# Altium schematic sheet CSA.SchDoc
size A
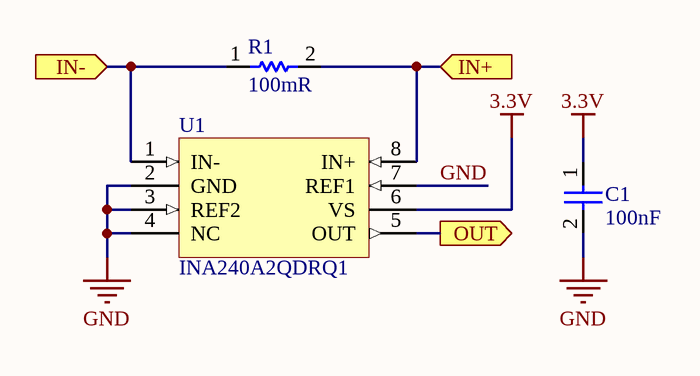
[diagram p0: CSA.SchDoc]

## Parts
C1  100nF  [MURA-0603_H_0.9_N]
R1  100mR  [RESC2512(6432)_N]
U1  INA240A2QDRQ1  [D0008A_M]

## Ports
IN+ (in), IN- (in), OUT (out)

## Nets
3.3V: C1.1 U1.6(VS)
GND: C1.2 U1.2(GND) U1.3(REF2) U1.4(NC) U1.7(REF1)
IN+: R1.2 U1.8(IN+) ; port IN+
IN-: R1.1 U1.1(IN-) ; port IN-
OUT: U1.5(OUT) ; port OUT

## Library data of the parts
C1 = C0603C104M4RAC7411: X7R,.1UF,20%,16V,UNMARKED, 1.0A 40V ROHS 3K<AZ; Manufacturer: KEMET; Dielectric Material: Ceramic; Dissipation Factor: 3.5%; Supplier 1: Digi-Key; Manufacturer Part Number: C0603C104M4RAC7411; RoHS: Yes; Category: Ceramic Capacitors; Stock 1: 270000; Pricing 1: 15000=0.00520, 30000=0.00494, 75000=0.00442, 105000=0.00358 (USD); Mount: Surface Mount; Case/Package: 0603; Case Code (Imperial): 0603; Case Code (Metric): 1608; Min Operating Temperature: -55°C; Max Operating Temperature: 125°C; Capacitance: 100nF; Package Quantity: 10000; Voltage Rating: 16V; Tolerance: 20%; Packaging: Tape and Reel; Voltage Rating (DC): 16V; Dielectric: X7R; Termination: SMD/SMT; Length: 1.6mm; Height: 0.8mm; Width: 0.8mm; Lead Pitch: 0.7mm; Thickness: 0.034inch; Depth: 0.8mm; Radiation Hardening: No; ComponentLink1URL: http://www.mouser.com/ds/2/212/KEM_C1002_X7R_SMD-1102033.pdf?src-supplier=Mouser; ComponentLink1Description: http://www.mouser.com/ds/2/212/KEM_C1002_X7R_SMD-1102033.pdf?src-supplier=Mouser; ComponentLink2URL: http://www.farnell.com/datasheets/2747785.pdf?src-supplier=Farnell; ComponentLink2Description: http://www.farnell.com/datasheets/2747785.pdf?src-supplier=Farnell; ComponentLink3URL: http://components.arrow.com/part/dataview/3446650S8993799N7429?src-supplier=Arrow; ComponentLink3Description: http://components.arrow.com/part/dataview/3446650S8993799N7429?src-supplier=Arrow; ComponentLink4URL: http://www.jameco.com/Jameco/Products/ProdDS/1565046.pdf?src-supplier=Jameco; ComponentLink4Description: http://www.jameco.com/Jameco/Products/ProdDS/1565046.pdf?src-supplier=Jameco; ComponentLink5URL: http://capacitoredge.kemet.com/capedge2/DataSheet?pn=C0603C104M4RAC7411&src-supplier=Avnet; ComponentLink5Description: http://capacitoredge.kemet.com/capedge2/DataSheet?pn=C0603C104M4RAC7411&src-supplier=Avnet; ComponentLink6URL: https://api.kemet.com/component-edge/download/datasheet/C0603C104M4RAC7411.pdf?src-supplier=Digi-Key; ComponentLink6Description: https://api.kemet.com/component-edge/download/datasheet/C0603C104M4RAC7411.pdf?src-supplier=Digi-Key; ComponentLink7URL: http://www.kemet.com/docfinder?Partnumber=C0603C104M4RAC7411&src-supplier=Digi-Key; ComponentLink7Description: http://www.kemet.com/docfinder?Partnumber=C0603C104M4RAC7411&src-supplier=Digi-Key; ComponentLink8URL: https://www.verical.com/server-webapp/html/getDatasheet?partID=58458&src-supplier=Verical; ComponentLink8Description: https://www.verical.com/server-webapp/html/getDatasheet?partID=58458&src-supplier=Verical; ComponentLink9URL: http://capacitoredge.kemet.com/capedge2/DataSheet?pn=C0603C104M4RAC7411&src-supplier=Avnet+Europe; ComponentLink9Description: http://capacitoredge.kemet.com/capedge2/DataSheet?pn=C0603C104M4RAC7411&src-supplier=Avnet+Europe; Supplier Part Number 1: 399-5784-2-ND
R1 = CRA2512FZR100ELF: BOURNS - CRA2512-FZ-R100ELF - SMD Current Sense Resistors, CR Series, 0.1 ohm, 3 W, - 1%, 2512 [6432 Metric] RoHS Compliant: Yes; Max Power Dissipation: 3W; Temperature Coefficient: 75ppm/°C; Supplier 1: Avnet; Manufacturer: Bourns; Manufacturer Part Number: CRA2512FZR100ELF; RoHS: Yes; Category: Chip SMD Resistors; Mount: Surface Mount; Case/Package: 2512; Number of Pins: 2; Contact Plating: Tin; Case Code (Imperial): 2512; Case Code (Metric): 6432; Min Operating Temperature: -55°C; Max Operating Temperature: 170°C; Packaging: Tape and Reel; Package Quantity: 1; Features: Moisture Resistant; Termination: SMD/SMT; Composition: Metal Film,Thick Film; Number of Terminations: 2; Military Standard: Not; Resistance: 100mR; Tolerance: 1%; Power Rating: 3W; Length: 6.4mm; Height: 0.6mm; Width: 3.2mm; Depth: 3.35mm; Radiation Hardening: No; REACH SVHC: No SVHC; ComponentLink1URL: https://datasheet.ciiva.com/2605/cra-2605648.pdf?src-supplier=Avnet; ComponentLink1Description: https://datasheet.ciiva.com/2605/cra-2605648.pdf?src-supplier=Avnet; ComponentLink2URL: https://datasheet.ciiva.com/11811/0900766b80ddce06-11811574.pdf?src-supplier=RSComponents; ComponentLink2Description: https://datasheet.ciiva.com/11811/0900766b80ddce06-11811574.pdf?src-supplier=RSComponents; ComponentLink3URL: https://datasheet.ciiva.com/22692/1849485-22692565.pdf?src-supplier=Element14; ComponentLink3Description: https://datasheet.ciiva.com/22692/1849485-22692565.pdf?src-supplier=Element14; ComponentLink4URL: https://datasheet.ciiva.com/30251/937cra-30251526.pdf?src-supplier=Onlinecomponents.com; ComponentLink4Description: https://datasheet.ciiva.com/30251/937cra-30251526.pdf?src-supplier=Onlinecomponents.com; ComponentLink5URL: https://datasheet.ciiva.com/2481/cra-2481805.pdf?src-supplier=Digi-Key; ComponentLink5Description: https://datasheet.ciiva.com/2481/cra-2481805.pdf?src-supplier=Digi-Key; ComponentLink6URL: https://datasheet.ciiva.com/2481/cra-2481806.pdf?src-supplier=Digi-Key; ComponentLink6Description: https://datasheet.ciiva.com/2481/cra-2481806.pdf?src-supplier=Digi-Key; ComponentLink7URL: https://datasheet.ciiva.com/1480/1849485-1480655.pdf?src-supplier=Element14; ComponentLink7Description: https://datasheet.ciiva.com/1480/1849485-1480655.pdf?src-supplier=Element14; ComponentLink8URL: https://datasheet.ciiva.com/2481/cra-2481807.pdf?src-supplier=Digi-Key; ComponentLink8Description: https://datasheet.ciiva.com/2481/cra-2481807.pdf?src-supplier=Digi-Key; Supplier Part Number 1: CRA2512-FZ-R100ELF
U1 = INA240A2QDRQ1: Op Amp Single Zero Drift Amplifier 5.5V Automotive 8-Pin SOIC T/R; Manufacturer: Texas Instruments; Supplier 1: Digi-Key; Manufacturer Part Number: INA240A2QDRQ1; Stock 1: 2396; Pricing 1: 1=2.81000, 10=2.52000, 25=2.38240, 100=1.95890, 250=1.75768, 500=1.69414, 1000=1.40826 (USD); Min Operating Temperature: -40°C; Max Operating Temperature: 150°C; ComponentLink1URL: http://www.ti.com/lit/ds/symlink/ina240-q1.pdf?src-supplier=Digi-Key; ComponentLink1Description: http://www.ti.com/lit/ds/symlink/ina240-q1.pdf?src-supplier=Digi-Key; ComponentLink2URL: https://octopart.com/click/track?ai=8629&ct=datasheets&sig=099bca6&at=physicalpart&sid=370&ppid=78638317&hlid=25178358&src-supplier=TI+store; ComponentLink2Description: https://octopart.com/click/track?ai=8629&ct=datasheets&sig=099bca6&at=physicalpart&sid=370&ppid=78638317&hlid=25178358&src-supplier=TI+store; ComponentLink3URL: http://sigma.octopart.com/49249642/technical_drawing/Texas-Instruments-INA240A2QDRQ1.pdf?src-supplier=TI+store; ComponentLink3Description: http://sigma.octopart.com/49249642/technical_drawing/Texas-Instruments-INA240A2QDRQ1.pdf?src-supplier=TI+store; Supplier Part Number 1: 296-49647-1-ND; Category: Integrated Circuits (ICs)